# Altium schematic sheet STM32F4_CPU.SchDoc
size A3; SheetNumber: 1; SheetTotal: 1; SPICEModelCacheGAGKWVZE: <root> / <DocumentId>GAGKWVZE</DocumentId> / <CacheFrame Number="0"> / <Model Name="cap" Kind="MDL"> / <Text>*Default semiconductor capacitor / .MODEL CAP C()</Text> / </Model> / <Model Name="led2" Kind="MDL"> / <Text>*Typ RED,GREEN,YELLOW,AMBER GaAs LED: Vf=2.1V Vr=4V If=40mA trr=3uS / *LED Pinout: 1=A, 2=K / .MODEL LED2 D (IS=93.1P RS=42M N=4.61 BV=4 IBV=10U / + CJO=2.97P VJ=.75 M=.333 TT=4.32U)</Text> / </Model> / </CacheFrame> / </root>
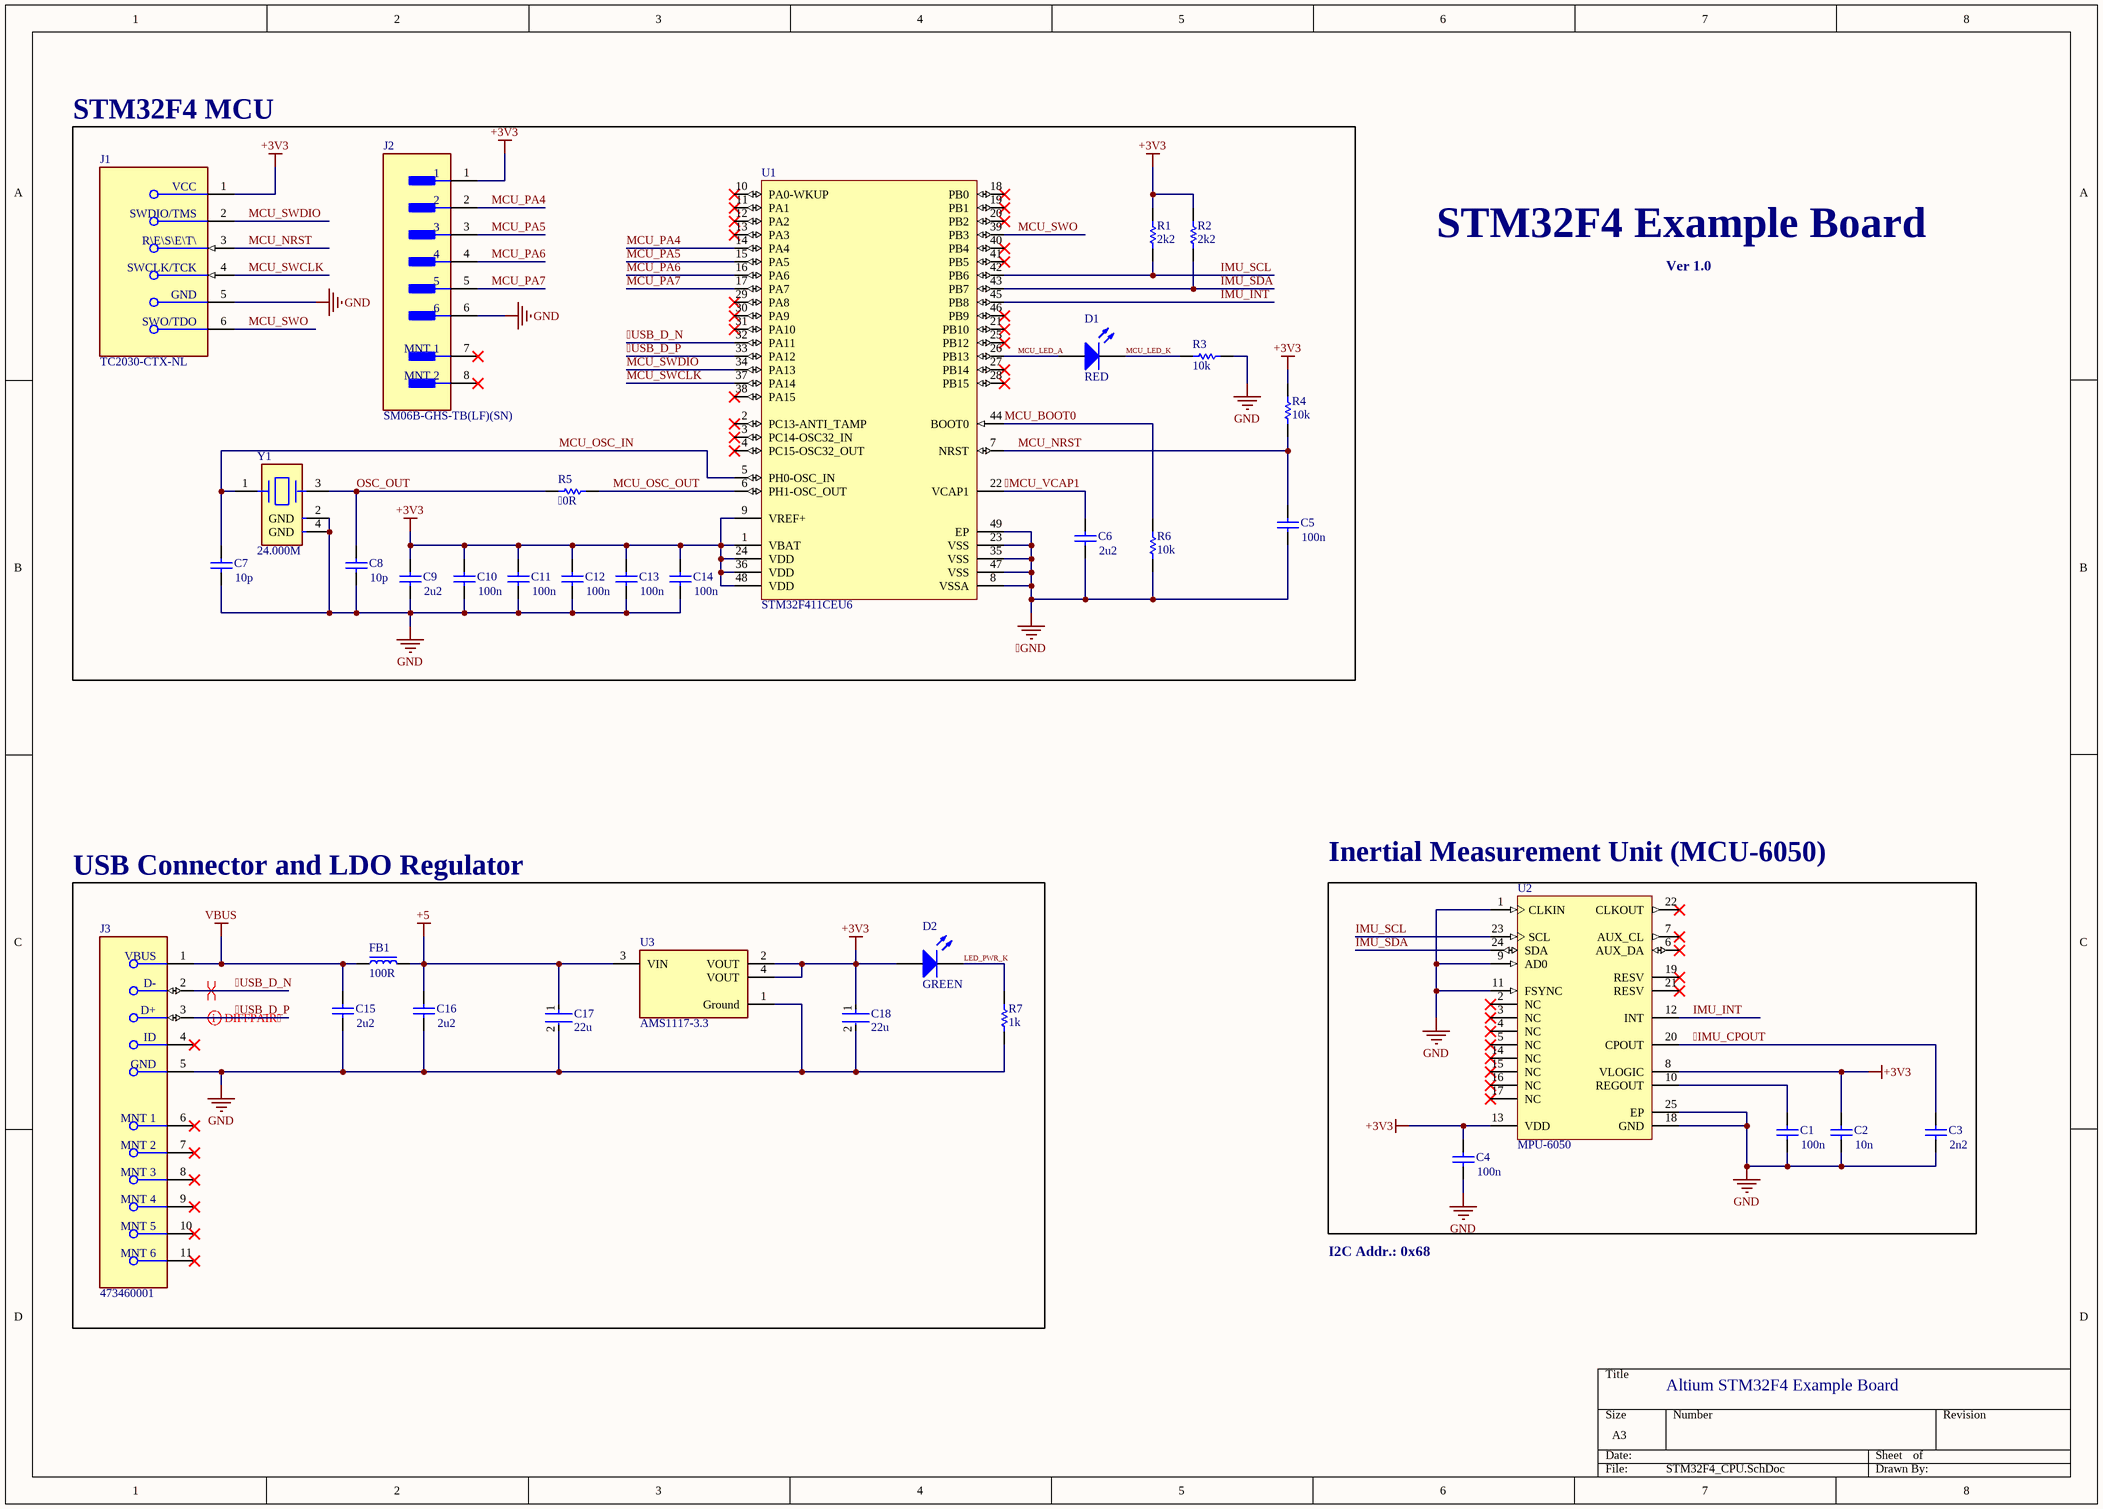
[diagram p0: STM32F4_CPU.SchDoc]

## Parts
C1  value 100n  [0402]  (hidden comment: Cap Semi)
C2  value 10n  [0402]  (hidden comment: Cap Semi)
C3  value 2n2  [0402]  (hidden comment: Cap Semi)
C4  value 100n  [0402]  (hidden comment: Cap Semi)
C5  value 100n  [0402]  (hidden comment: Cap Semi)
C6  value 2u2  [1608[0603]]  (hidden comment: Cap Semi)
C7  value 10p  [0402]  (hidden comment: Cap Semi)
C8  value 10p  [0402]  (hidden comment: Cap Semi)
C9  value 2u2  [1608[0603]]  (hidden comment: Cap Semi)
C10  value 100n  [0402]  (hidden comment: Cap Semi)
C11  value 100n  [0402]  (hidden comment: Cap Semi)
C12  value 100n  [0402]  (hidden comment: Cap Semi)
C13  value 100n  [0402]  (hidden comment: Cap Semi)
C14  value 100n  [0402]  (hidden comment: Cap Semi)
C15  value 2u2  [1608[0603]]  (hidden comment: Cap Semi)
C16  value 2u2  [1608[0603]]  (hidden comment: Cap Semi)
C17  22u  [FP-CL21-IPC_A]
C18  22u  [FP-CL21-IPC_A]
D1  RED  [3.2X1.6X1.1]
D2  GREEN  [3.2X1.6X1.1]
FB1  100R  [FB_0402]
J1  TC2030-CTX-NL  [FP-TC2030-CTX-NL-MFG]
J2  SM06B-GHS-TB(LF)(SN)  [FP-SM06B-GHS-TB_LF_SN-MFG]
J3  473460001  [FP-473460001-MFG]
R1  2k2  [RESC1005X40X25ML05T05]
R2  2k2  [RESC1005X40X25ML05T05]
R3  10k  [RESC1005X40X25ML05T05]
R4  10k  [RESC1005X40X25ML05T05]
R5  0R  [RESC1005X40X25ML05T05]
R6  10k  [RESC1005X40X25ML05T05]
R7  1k  [RESC1005X40X25ML05T05]
U1  STM32F411CEU6  [STM-UFQFPN48_L]
U2  MPU-6050  [IS-QFN-24_V]
U3  AMS1117-3.3  [FP-AMS1117-IPC_C]
Y1  24.000M  [FP-7M-MFG]

## Blocks framed on the sheet
STM32F4 MCU: C5-C14 D1 J1 J2 R1-R6 U1 Y1
USB Connector and LDO Regulator: C15-C18 D2 FB1 J3 R7 U3
Inertial Measurement Unit (MCU-6050): C1-C4 U2

## Nets
GND: C5.1 C6.1 R6.1 U1.8(VSSA) U1.23(VSS) U1.35(VSS) U1.47(VSS) U1.49(EP)
+3V3: C2.2 C4.2 C9.2 C10.2 C11.2 C12.2 C13.2 C14.2 C18.1 D2.1(A) J1.1(VCC) J2.1 R1.2 R2.2 R4.2 U1.1(VBAT) U1.9(VREF+) U1.24(VDD) U1.36(VDD) U1.48(VDD) U2.8(VLOGIC) U2.13(VDD) U3.2(VOUT) U3.4(VOUT)
+5: C16.2 C17.1 FB1.2 U3.3(VIN)
GND: C1.1 C2.1 C3.1 C4.1 C7.1 C8.1 C9.1 C10.1 C11.1 C12.1 C13.1 C14.1 C15.1 C16.1 C17.2 C18.2 J1.5(GND) J2.6 J3.5(GND) R3.1 R7.1 U2.1(CLKIN) U2.9(AD0) U2.11(FSYNC) U2.18(GND) U2.25(EP) U3.1(Ground) Y1.2(GND) Y1.4(GND)
VBUS: C15.2 FB1.1 J3.1(VBUS)
IMU_CPOUT: C3.2 U2.20(CPOUT)
MCU_VCAP1: C6.2 U1.22(VCAP1)
USB_D_N: J3.2(D-) U1.32(PA11)
USB_D_P: J3.3(D+) U1.33(PA12)
IMU_INT: U1.45(PB8) U2.12(INT)
IMU_SCL: R1.1 U1.42(PB6) U2.23(SCL)
IMU_SDA: R2.1 U1.43(PB7) U2.24(SDA)
LED_PWR_K: D2.2(K) R7.2
MCU_BOOT0: R6.2 U1.44(BOOT0)
MCU_LED_A: D1.1(A) U1.26(PB13)
MCU_LED_K: D1.2(K) R3.2
MCU_NRST: C5.2 J1.3(~{RESET}) R4.1 U1.7(NRST)
MCU_OSC_IN: C7.2 U1.5(PH0-OSC_IN) Y1.1
MCU_OSC_OUT: R5.1 U1.6(PH1-OSC_OUT)
MCU_PA4: J2.2 U1.14(PA4)
MCU_PA5: J2.3 U1.15(PA5)
MCU_PA6: J2.4 U1.16(PA6)
MCU_PA7: J2.5 U1.17(PA7)
MCU_SWCLK: J1.4(SWCLK/TCK) U1.37(PA14)
MCU_SWDIO: J1.2(SWDIO/TMS) U1.34(PA13)
MCU_SWO: J1.6(SWO/TDO) U1.39(PB3)
OSC_OUT: C8.2 R5.2 Y1.3
NetC1_2: C1.2 U2.10(REGOUT)

Not connected (* = marked no-connect by the designer): J2 7(MNT_1)* 8(MNT_2)*; J3 4(ID)* 6(MNT_1)* 7(MNT_2)* 8(MNT_3)* 9(MNT_4)* 10(MNT_5)* 11(MNT_6)*; U1 2(PC13-ANTI_TAMP)* 3(PC14-OSC32_IN)* 4(PC15-OSC32_OUT)* 10(PA0-WKUP)* 11(PA1)* 12(PA2)* 13(PA3)* 18(PB0)* 19(PB1)* 20(PB2)* 21(PB10)* 25(PB12)* 27(PB14)* 28(PB15)* 29(PA8)* 30(PA9)* 31(PA10)* 38(PA15)* 40(PB4)* 41(PB5)* 46(PB9)*; U2 2(NC)* 3(NC)* 4(NC)* 5(NC)* 6(AUX_DA)* 7(AUX_CL)* 14(NC)* 15(NC)* 16(NC)* 17(NC)* 19(RESV)* 21(RESV)* 22(CLKOUT)*

## Layout directives
differential pair; differential pair class USB_DIFF: USB_D_N, USB_D_P

## Notes on the sheet
- STM32F4 Example Board
- Ver 1.0
- I2C Addr.: 0x68
- Altium STM32F4 Example Board

## Library data of the parts
C1-C16 = Cap Semi: Capacitor (Semiconductor SIM Model); Published: 8-Jun-2000; LatestRevisionDate: 29-May-2009; LatestRevisionNote: IPC-7351 Footprint Added.; PackageReference: C1206; Publisher: Altium Limited; PackageDescription: Chip Capacitor
C17 C18 = CMP-13271-000820-1: CL21 Series 0805 22uF 16V ±10% Tolerance X5R Multilayer Ceramic Chip Capacitor; Length: 0.079inch; Tolerance: 10%; Capacitance: 22uF; Thickness: 0.055inch; Case Code (Metric): 2012; Width: 0.049inch; Min Operating Temperature: -55°C; Voltage Rating: 16V; Max Operating Temperature: 85°C; Mount: Surface Mount; Voltage Rating (DC): 16V; Case/Package: 0805; Case Code (Imperial): 0805; Lead Free: Lead Free; Packaging: Tape and Reel
D1 D2 = LED2: Typical RED, GREEN, YELLOW, AMBER GaAs LED; Published: 8-Jun-2000; LatestRevisionDate: 17-Jul-2002; LatestRevisionNote: Re-released for DXP Platform.; PackageVersion: Feb-2002; PackageReference: 3.2X1.6X1.1; Publisher: Altium Limited; PackageDescription: SM LED; 2 Flat Leads
FB1 = FB_0402: Ferrite Bead SMD 0402
J1 = CMP-205963-000001-1: 6-Pin “No legs” TC2030 Plug-of-Nails™ Cable for use with ARM Cortex processors
J2 = CMP-17439-000061-1: CONN HEADER SMD R/A 6POS 1.25MM; Number of Contacts: 6; Voltage Rating: 50V; Current Rating: 1A; Connector Type: Outer Shroud Contact; Contact Resistance: 50mR; Orientation: Right Angle; Max Operating Temperature: 85°C; Mount: Surface Mount; Packaging: Tape and Reel; Contact Plating: Tin; Depth: 4.05mm; Max Voltage Rating (AC): 50V; Lead Free: Lead Free; Pitch: 1.25mm; Number of Positions: 6; Max Current Rating: 1A; Termination: Solder; Min Operating Temperature: -25°C; Housing Color: Beige; Fastening Type: Ramp; Length: 10.75mm; Color: Natural; Contact Material: Bronze; Housing Material: Polyamide; Number of Rows: 1
J3 = CMP-2000-05246-2: CONN RCPT USB2.0 MICRO B SMD R/A; Manufacturer: Molex; Conn Orientation: Right Angle; Is Female: yes; Shielding: true; Pitch: 0.65mm; Number Of Contacts: 5; Voltage Rating: 30V; Current Rating: 1.8A; Device Class L2: USB Connectors; Digikey Description: CONN RCPT USB2.0 MICRO B SMD R/A; Height: 2.945mm; RoHS: TRUE; ComponentLink2Description: Datasheet; Octopart: https://octopart.com/47346-0001-molex-7164928; Automotive: No; Package: 0; Category: Conn; Device Class L1: Connectors; Usb Standard: USB 2.0; Temperature: -30°C to +85°C; Temperature Range Low: -30°C; Footprint Url: https://www.molex.com/pdm_docs/sd/473460001_sd.pdf; ComponentLink2URL: https://www.molex.com/webdocs/datasheets/pdf/en-us/0473460001_IO_CONNECTORS.pdf; Lead Free: Yes; Manufacturer Part Number: 473460001; Contact Material: Gold,Nickel; Temperature Range High: +85°C; Device Class L3: unset
R1-R7 = CMP-2002-00433-1: Part Number: ERJ-2GEJ103X; Manufacturer: Panasonic
U1 = CMP-0243-00165-1: ARM Cortex-M4 32-bit MCU+FPU, 512 KB Flash, 128 KB RAM, 36 I/Os, 48-Pin UFQFPN, -40 to 85 degC, Tray; Operating Frequency(F) (Processor speed) (MHz): 100; FLASH Size (Prog) (kB): 512; Internal RAM Size (kB): 128; I/Os (High Current): 36; Supply Voltage(Vcc) min (V): 1.7; Package Reference: 48-Pin Ultra Thin Fine Pitch Quad Flat No-Lead, 7 x 7 x 0.6 mm Body, 0.5 mm Pitch, Exposed Pad; ComponentLink1Description: Manufacturer URL; ComponentLink1URL: http://www.st.com/; Packing: Tray; Package Description: UFQFPN48; Core: ARM Cortex-M4; ComponentLink2Description: Datasheet; ComponentLink2URL: http://www.st.com/st-web-ui/static/active/en/resource/technical/document/datasheet/DM00115249.pdf; DatasheetVersion: Rev. 6; Mounting Technology: Surface Mount
U2 = CMP-1753-00002-2: 3-Axis Gyroscope, Accelerometer and a Digital Motion Processor(TM) (DMP), 2.375 to 3.46 V, -40 to 85 degC, 24-Pin QFN, RoHS, Tape and Reel; Manufacturer: InvenSense; Featured Product: MPU-60506-Axis,IntegratedI²CSolution; Other Names: 1428-1007-2 / MPU6050; Sensor Type: MotionTracking; Online Catalog: MPU-6000™Series; Unit PriceUSD: Digital; Datasheet Version: Rev. 3.3, 05/2012; Category: Sensors,Transducers; Datasheet URL: http://datasheet.octopart.com/MPU-6050-InvenSense-datasheet-14421344.pdf; Family: Multifunction; Standard Package: 5,000; Manufacturer URL: http://www.invensense.com/; Output Type: Digital; Dynamic Catalog: MPU-6000™Series
U3 = CMP-209535-000001-1: LDO Voltage Regulators 1A, 3.3V; Manufacturer: Advanced Monolithic Systems; Dropout Voltage: 1.1V; Output Type: Fixed; Nominal Supply Current: 5mA; Max Power Dissipation: 1.2W; Max Supply Voltage: 15V; Number Of Outputs: 1; Standoff Height: 0.64mm; Max Junction Temp: +125°C; Height: 1.8mm; Package: AMS1117; Device Class L2: Power Management ICs; ComponentLink2Description: Datasheet; ComponentLink2URL: http://www.advanced-monolithic.com/pdf/ds1117.pdf; Category: IC; RoHS: TRUE; Automotive: No; Device Class L1: Integrated Circuits (ICs); Output Current: 1A; Device Class L3: Voltage Regulators - Linear; Temperature: -40°C to +125°C; Output Voltage: 3.3V; Manufacturer Part Number: AMS1117-3.3; Temperature Range Low: -40°C; Octopart: https://octopart.com/ams1117-3.3-advanced+monolithic+systems-25899300; Lead Free: Yes; Ipc Land Pattern Name: SOT229P700X180-4; Temperature Range High: +125°C
Y1 = CMP-18717-000318-1: Crystal 24MHz, 10ppm, 10pF, 50Ω; ESR (Equivalent Series Resistance): 60R; Lead Free: Lead Free; Packaging: Tape and Reel; Length: 3.2mm; Frequency: 24MHz; Load Capacitance: 10pF; REACH SVHC: No SVHC; Width: 0.098inch; Height: 0.031inch; Tolerance: 10ppm; Frequency Stability: 10ppm; Min Operating Temperature: -20°C; Max Operating Temperature: 70°C; Frequency Tolerance: 10ppm; Number of Pins: 4; Mount: Surface Mount; Termination: SMD/SMT; Case/Package: SMD/SMT; Package Quantity: 3000; Depth: 2.5mm; Series: 7M